# Altium project ARDevelopmentPlat.PrjPCB
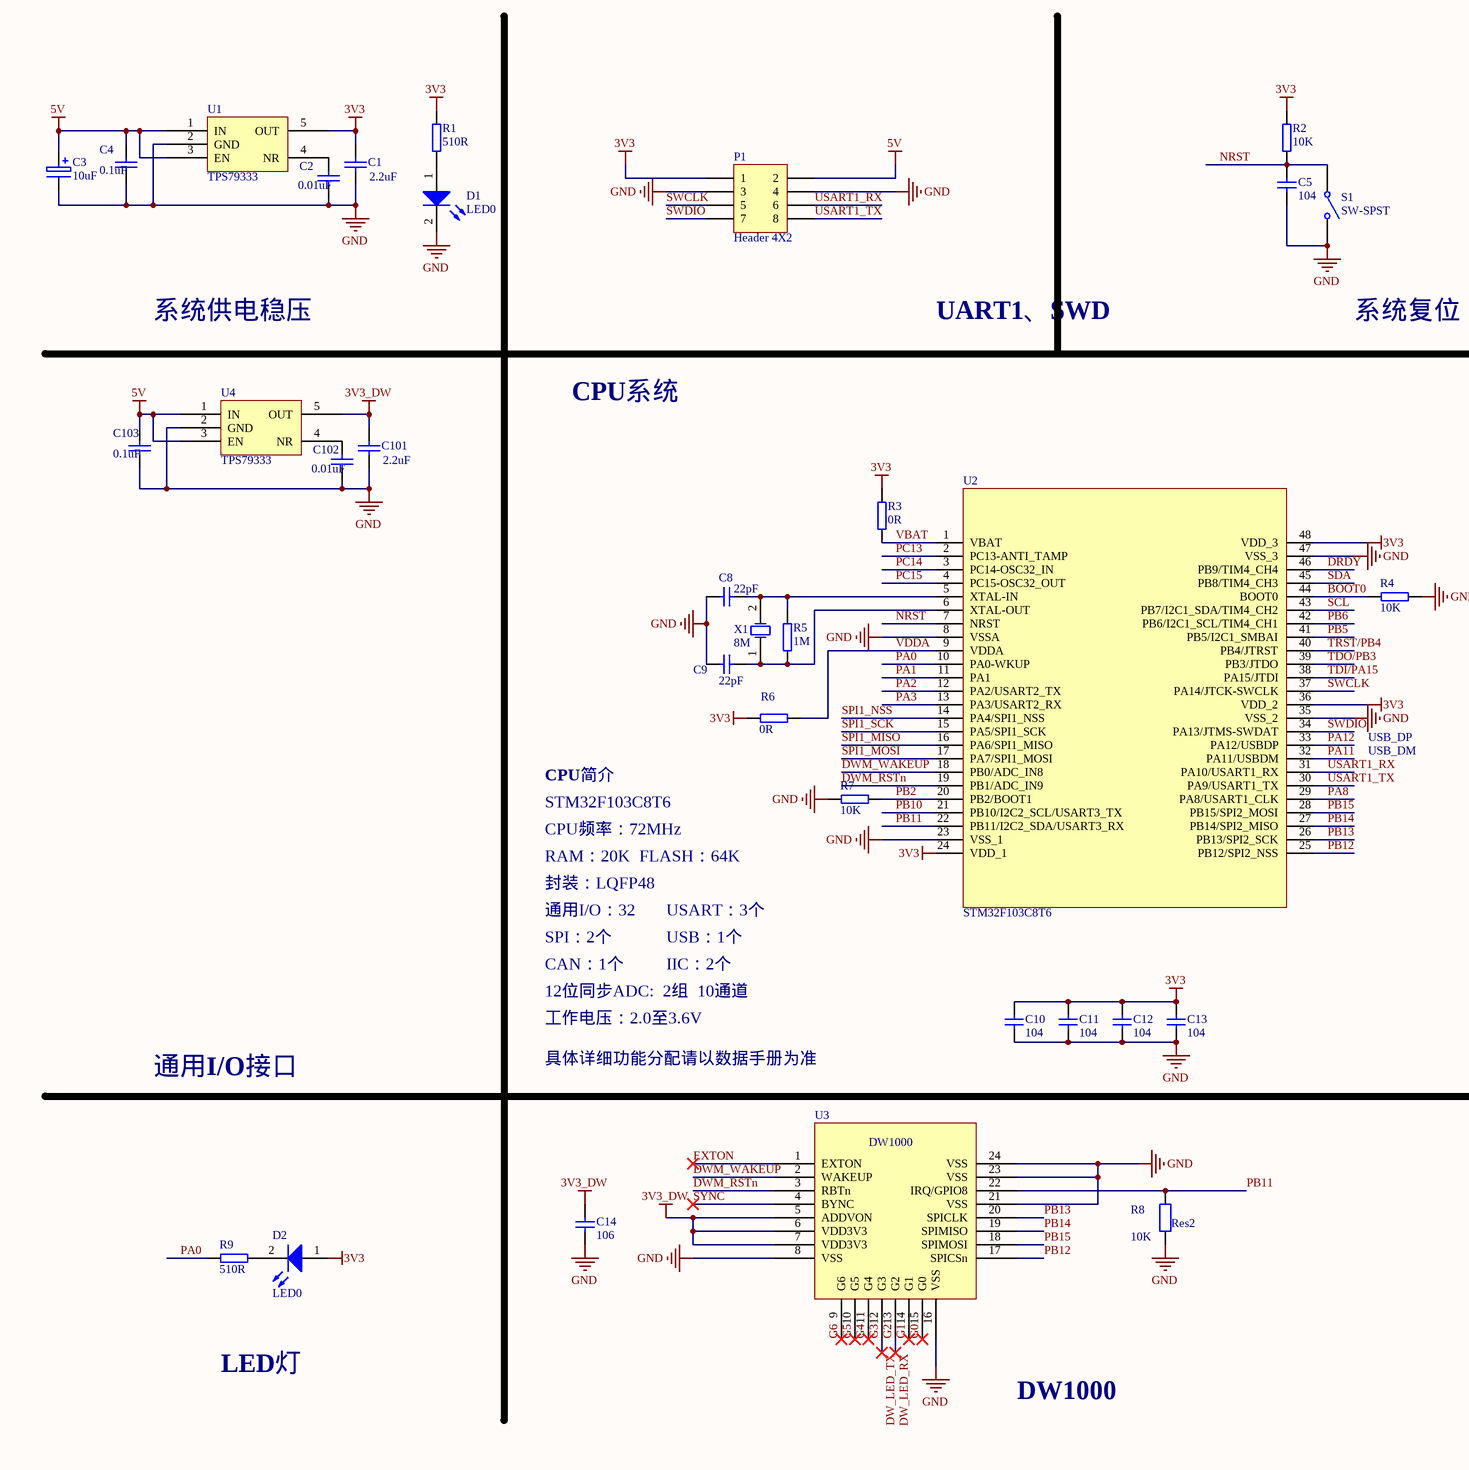
[diagram p0: ARDevelopmentPlat.SchDoc, left]
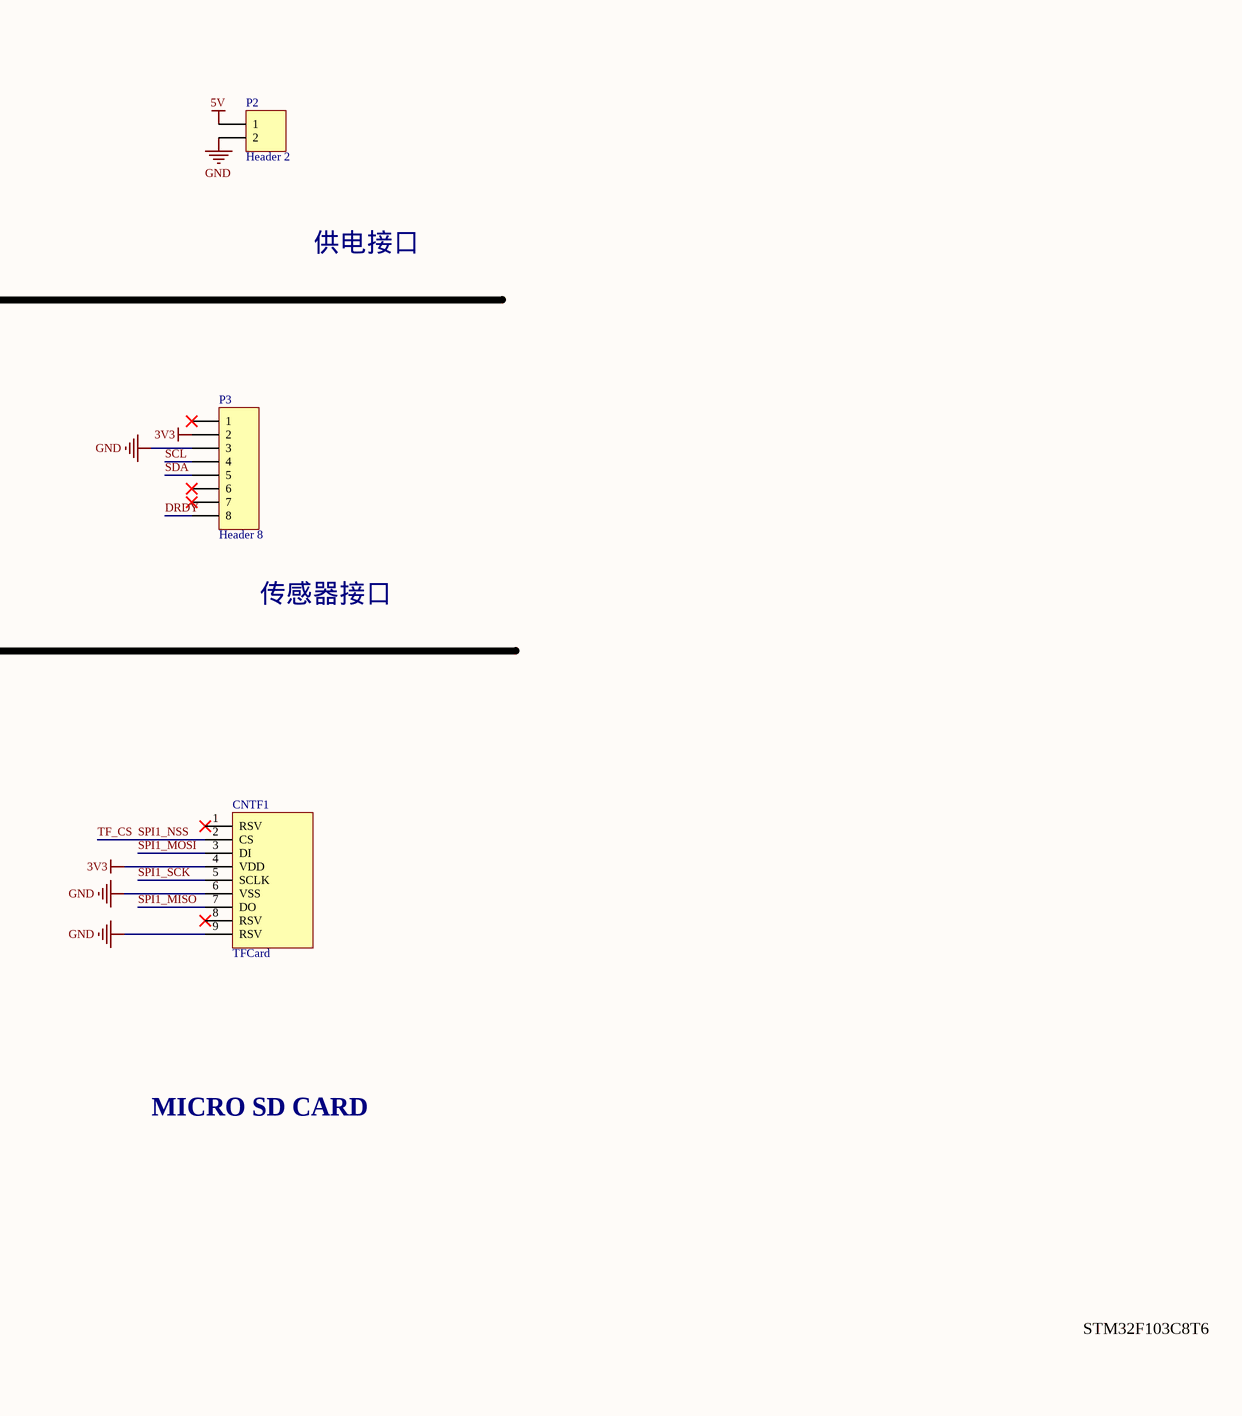
[diagram p1: ARDevelopmentPlat.SchDoc, right]
1 sheet, 36 parts. Net scope: global (net labels, ports and power ports of the same name join across sheets).
Board file: ARDevelopmentPlat.PcbDoc

## Sheet ARDevelopmentPlat.SchDoc
size A3

### Parts
C1  value 2.2uF  [RC0603]  (hidden comment: Cap)
C2  value 0.01uF  [RC0603]  (hidden comment: Cap)
C3  10uF  [RC0805]
C4  value 0.1uF  [RC0603]  (hidden comment: Cap)
C5  104  [RC0603]
C8  22pF  [RC0603]
C9  22pF  [RC0603]
C10  104  [RC0603]
C11  104  [RC0603]
C12  104  [RC0603]
C13  104  [RC0603]
C14  106  [RC0805]
C101  value 2.2uF  [RC0603]  (hidden comment: Cap)
C102  value 0.01uF  [RC0603]  (hidden comment: Cap)
C103  value 0.1uF  [RC0603]  (hidden comment: Cap)
CNTF1  TFCard  [MICRO SD]
D1  LED0  [LED0805]
D2  LED0  [LED0805]
P1  Header 4X2  [HDR2X4]
P2  Header 2  [HDR1X2]
P3  Header 8  [HDR1X8]
R1  510R  [RC0603]
R2  10K  [RC0603]
R3  0R  [RC0603]
R4  10K  [RC0603]
R5  1M  [RC0603]
R6  0R  [RC0603]
R7  10K  [RC0603]
R8  Res2  value 10K  [RC0603]
R9  510R  [RC0603]
S1  SW-SPST  [SMT-KEY]
U1  TPS79333  [SOT-23-5]
U2  STM32F103C8T6  [LQFP48]
U3  DW1000  [DWM1000]
U4  TPS79333  [SOT-23-5]
X1  8M  [SMD5032]

### Nets
3V3: C1.2 C10.1 C11.1 C12.1 C13.1 CNTF1.4(VDD) D2.1(A) P1.1 P3.2 R1.2 R2.2 R3.2 R6.2 U1.5(OUT) U2.24(VDD_1) U2.36(VDD_2) U2.48(VDD_3)
3V3_DW: C14.1 C101.2 U3.5(ADDVON) U3.6(VDD3V3) U3.7(VDD3V3) U4.5(OUT)
5V: C3.1 C4.2 C103.2 P1.2 P2.1 U1.1(IN) U1.3(EN) U4.1(IN) U4.3(EN)
GND: C1.1 C2.1 C3.2 C4.1 C5.2 C8.2 C9.2 C10.2 C11.2 C12.2 C13.2 C14.2 C101.1 C102.1 C103.1 CNTF1.6(VSS) CNTF1.9(RSV) D1.2(K) P1.3 P1.4 P2.2 P3.3 R4.1 R7.2 R8.1 S1.2(NO) U1.2(GND) U2.8(VSSA) U2.23(VSS_1) U2.35(VSS_2) U2.47(VSS_3) U3.8(VSS) U3.16(VSS) U3.21(VSS) U3.23(VSS) U3.24(VSS) U4.2(GND)
BOOT0: R4.2 U2.44(BOOT0)
DRDY: P3.8 U2.46(PB9/TIM4_CH4)
DW_LED_RX: U3.13(G2)  [also labelled G2]
DW_LED_TX: U3.12(G3)  [also labelled G3]
DWM_RSTn: U2.19(PB1/ADC_IN9) U3.3(RBTn)
DWM_WAKEUP: U2.18(PB0/ADC_IN8) U3.2(WAKEUP)
EXTON: U3.1(EXTON)
G0: U3.15(G0)
G1: U3.14(G1)
G4: U3.11(G4)
G5: U3.10(G5)
G6: U3.9(G6)
NRST: C5.1 R2.1 S1.1(COMMON) U2.7(NRST)
PA0: R9.1 U2.10(PA0-WKUP)
PA1: U2.11(PA1)
PA2: U2.12(PA2/USART2_TX)
PA3: U2.13(PA3/USART2_RX)
PA8: U2.29(PA8/USART1_CLK)
PA11: U2.32(PA11/USBDM)
PA12: U2.33(PA12/USBDP)
PB2: R7.1 U2.20(PB2/BOOT1)
PB5: U2.41(PB5/I2C1_SMBAI)
PB6: U2.42(PB6/I2C1_SCL/TIM4_CH1)
PB10: U2.21(PB10/I2C2_SCL/USART3_TX)
PB11: R8.2 U2.22(PB11/I2C2_SDA/USART3_RX) U3.22(IRQ/GPIO8)
PB12: U2.25(PB12/SPI2_NSS) U3.17(SPICSn)
PB13: U2.26(PB13/SPI2_SCK) U3.20(SPICLK)
PB14: U2.27(PB14/SPI2_MISO) U3.19(SPIMISO)
PB15: U2.28(PB15/SPI2_MOSI) U3.18(SPIMOSI)
PC13: U2.2(PC13-ANTI_TAMP)
PC14: U2.3(PC14-OSC32_IN)
PC15: U2.4(PC15-OSC32_OUT)
SCL: P3.4 U2.43(PB7/I2C1_SDA/TIM4_CH2)
SDA: P3.5 U2.45(PB8/TIM4_CH3)
SPI1_MISO: CNTF1.7(DO) U2.16(PA6/SPI1_MISO)
SPI1_MOSI: CNTF1.3(DI) U2.17(PA7/SPI1_MOSI)
SPI1_NSS: CNTF1.2(CS) U2.14(PA4/SPI1_NSS)  [also labelled TF_CS]
SPI1_SCK: CNTF1.5(SCLK) U2.15(PA5/SPI1_SCK)
SWCLK: P1.5 U2.37(PA14/JTCK-SWCLK)
SWDIO: P1.7 U2.34(PA13/JTMS-SWDAT)
SYNC: U3.4(BYNC)
TDI/PA15: U2.38(PA15/JTDI)
TDO/PB3: U2.39(PB3/JTDO)
TRST/PB4: U2.40(PB4/JTRST)
USART1_RX: P1.6 U2.31(PA10/USART1_RX)
USART1_TX: P1.8 U2.30(PA9/USART1_TX)
VBAT: R3.1 U2.1(VBAT)
VDDA: R6.1 U2.9(VDDA)
NetC2_2: C2.2 U1.4(NR)
NetC8_1: C8.1 R5.2 U2.5(XTAL-IN) X1.2
NetC9_1: C9.1 R5.1 U2.6(XTAL-OUT) X1.1
NetC102_2: C102.2 U4.4(NR)
NetD1_1: D1.1(A) R1.1
NetD2_2: D2.2(K) R9.2

Not connected (* = marked no-connect by the designer): CNTF1 1(RSV)* 8(RSV)*; P3 1* 6* 7*

### Notes on the sheet
- 系统供电稳压
- UART1、SWD
- 系统复位
- 供电接口
- CPU系统
- 传感器接口
- USB_DM
- USB_DP
- STM32F103C8T6
- CPU简介
- RAM：20K
- 封装：LQFP48
- CPU频率：72MHz
- FLASH：64K
- 通用I/O：32
- SPI：2个
- USART：3个
- USB：1个
- CAN：1个
- 12位同步ADC:  2组  10通道
- 工作电压：2.0至3.6V
- IIC：2个
- 通用I/O接口
- 具体详细功能分配请以数据手册为准
- MICRO SD CARD
- LED灯
- DW1000

### Library data of the parts
C1 C2 C4 C101-C103 = Cap: Capacitor; Published: 8-Jun-2000; LatestRevisionDate: 17-Jul-2002; LatestRevisionNote: Re-released for DXP Platform.; PackageReference: RAD-0.3; Publisher: Altium Limited; PackageDescription: Radial Cap, Thru-Hole; 2 Leads; 0.3 in Pin Spacing
C3 = cap_polarity2: Electrolytic Capacitor
C5 C10-C14 = CAP1: Capacitor; Tolerate: 50V; Value: 100nF; TOL: 10%; ERP: 0103020075; PCB_Layout: Top Layer SMC; Revision: 2012-3-28; Publisher: ZL_A0OFFICE
C8 C9 = CAP1: Capacitor; Tolerate: 50V; Value: 20pF; TOL: 2%; ERP: 0103020090; PCB_Layout: Top Layer SMC; Revision: 2012-3-28; Publisher: ZL_A0OFFICE
D1 D2 = LED0: Typical INFRARED GaAs LED
P1 = Header 4X2: Header, 4-Pin, Dual row; LatestRevisionDate: 17-Jul-2002; LatestRevisionNote: Re-released for DXP Platform.; Publisher: Altium Limited
P2 = Header 2: Header, 2-Pin; LatestRevisionDate: 17-Jul-2002; LatestRevisionNote: Re-released for DXP Platform.; Publisher: Altium Limited
P3 = Header 8: Header, 8-Pin; LatestRevisionDate: 17-Jul-2002; LatestRevisionNote: Re-released for DXP Platform.; Publisher: Altium Limited
R1-R7 R9 = R
R8 = Res2: Resistor; Published: 8-Jun-2000; LatestRevisionDate: 17-Jul-2002; LatestRevisionNote: Re-released for DXP Platform.; PackageReference: AXIAL-0.4; Publisher: Altium Limited; PackageDescription: Axial Device, Thru-Hole; 2 Leads; 0.4 in Pin Spacing
S1 = SW-SPST: Single-Pole, Single-Throw Switch
X1 = XTAL_SMD: Crystal Oscillator; ERP: 0103040021; Value: 8MHz; TOL: ±20ppm; Tolerate: ROSON -20_+70 20pf; PCB_Layout: Top Layer SMC; Publisher: ZL_A0OFFICE; Revision: 2012-3-28